# EasyEDA schematic schematic32MB.json
TITLE: Logger; REV: 1.0; Date: 2020-02-24; Sheet: 1/1; Drawn By: alexeystn; Company: alexeystn
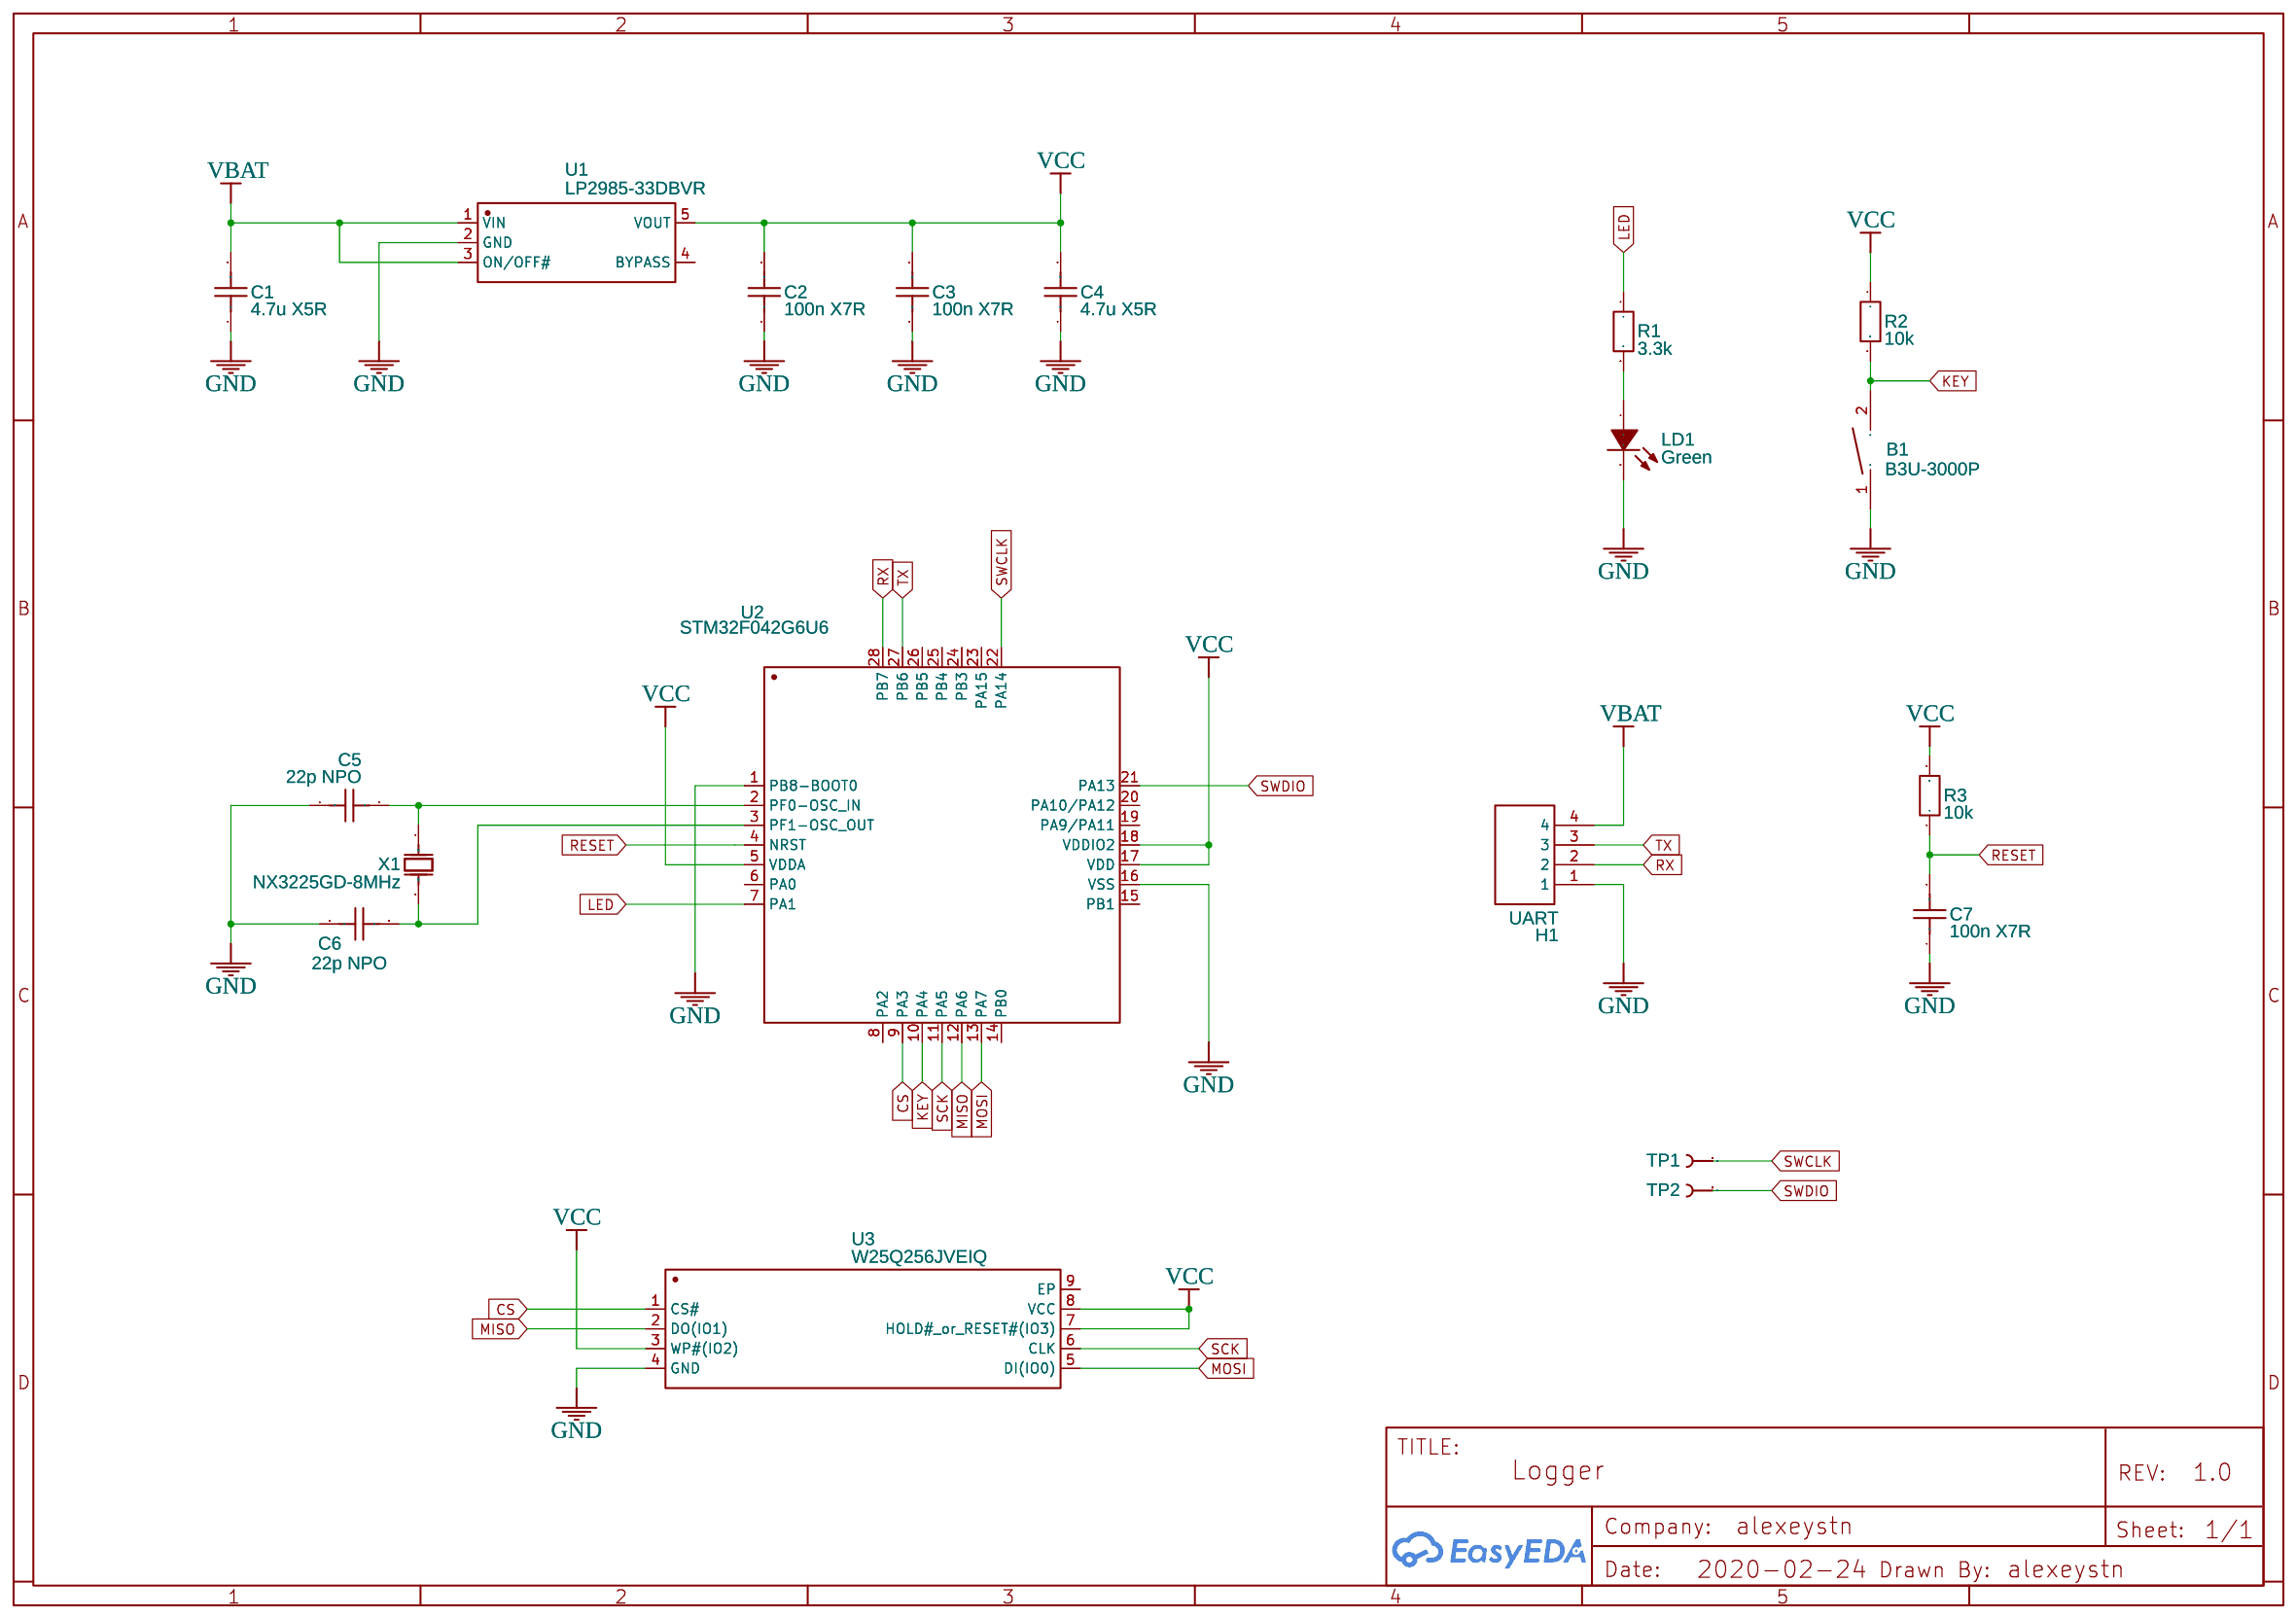
[diagram p0: schematic sheet]

## Parts
B1  B3U-3000P  [KEY-SMD_B3U-3000PM-B_COPY]
C1  4.7u X5R  [0603]
C2  100n X7R  [0603]
C3  100n X7R  [0603]
C4  4.7u X5R  [0603]
C5  22p NPO  [0603]
C6  22p NPO  [0603]
C7  100n X7R  [0603]
H1  UART  [2.00MM_1X4_CONNECTOR]
LD1  Green  [0805]
R1  3.3k  [0603]
R2  10k  [0603]
R3  10k  [0603]
TP1  TEST-POINT3  [PAD.03X.03]
TP2  TEST-POINT3  [PAD.03X.03]
U1  LP2985-33DBVR  [SOT-23-5_L3.0-W1.7-P0.95-LS2.8-BR]
U2  STM32F042G6U6  [QFN-28_L4.0-W4.0-P0.50-BL]
U3  W25Q256JVEIQ  [WSON-8_L6.0-W8.0-P1.27-BL-EP]
X1  NX3225GD-8MHz  [RESC3226X100N-WIDE-SILK]

## Library data of the parts
B1 = B3U-3000PM-B: Supplier: LCSC; Supplier Part: C306884; Manufacturer: Omron Electronics; Contributor: LCSC
C1-C7 = Cap_0805_US
H1 = 220S-1*4P H=8.5MM Ytype Gold-plated: Supplier: LCSC; Manufacturer: Ckmtw; Contributor: LCSC; Supplier Part: C124413
LD1 = 17-21SURC/S530-A2/TR8: Supplier: LCSC; Manufacturer: EVERLIGHT; Contributor: LCSC; Supplier Part: C131244
R1 R2 = Res_0805(1/8W)_EU
R3 = Res_0805(1/8W)_EU: Package Display: No
TP1 TP2 = TEST-POINT3: Bare copper test points for troubleshooting or ICT; Contributor: SparkFun
U1 = LP2985-33DBVR: Supplier: LCSC; Manufacturer: TI; Supplier Part: C95414; SMT Type: Extend; JLCPCB SMD: Yes
U2 = STM32F042G4U6: Supplier: LCSC; Manufacturer: STMicroelectronics; Supplier Part: C88048; SMT Type: Extend; JLCPCB SMD: Yes
U3 = W25Q256JVEIQ: Supplier: LCSC; Supplier Part: C2682312; Manufacturer: WINBOND(华邦); Contributor: LCSC
X1 = NX3225GD-8MHZ-STD-CRA-3: Contributor: Alvaro Loa

## Nets
GND: B1.1 C1.1 C2.1 C3.1 C4.1 C5.1 C6.1 C7.1 H1.1 LD1.2(K) U1.2(GND) U2.1(PB8-BOOT0) U2.16(VSS) U3.4(GND)
VBAT: C1.2 H1.4 U1.1(VIN) U1.3(ON/OFF#)
VCC: C2.2 C3.2 C4.2 R2.1 R3.2 U1.5(VOUT) U2.5(VDDA) U2.17(VDD) U2.18(VDDIO2) U3.3(WP#(IO2)) U3.7(HOLD# or RESET#(IO3)) U3.8(VCC)
CS: U2.9(PA3) U3.1(CS#)
KEY: B1.2 R2.2 U2.10(PA4)
LED: R1.1 U2.7(PA1)
MISO: U2.12(PA6) U3.2(DO(IO1))
MOSI: U2.13(PA7) U3.5(DI(IO0))
RESET: C7.2 R3.1 U2.4(NRST)
RX: H1.2 U2.28(PB7)
SCK: U2.11(PA5) U3.6(CLK)
SWCLK: TP1.P$1(1) U2.22(PA14)
SWDIO: TP2.P$1(1) U2.21(PA13)
TX: H1.3 U2.27(PB6)
Net-(C5-2): C5.2 U2.2(PF0-OSC_IN) X1.1(OSC1)
Net-(C6-2): C6.2 U2.3(PF1-OSC_OUT) X1.2(OSC2)
Net-(LD1-1): LD1.1(A) R1.2

Not connected (* = marked no-connect by the designer): U1 4(BYPASS); U2 6(PA0) 8(PA2) 14(PB0) 15(PB1) 19(PA9/PA11) 20(PA10/PA12) 23(PA15) 24(PB3) 25(PB4) 26(PB5); U3 9(EP)
